# Altium schematic sheet [04] - Display.SchDoc
size A
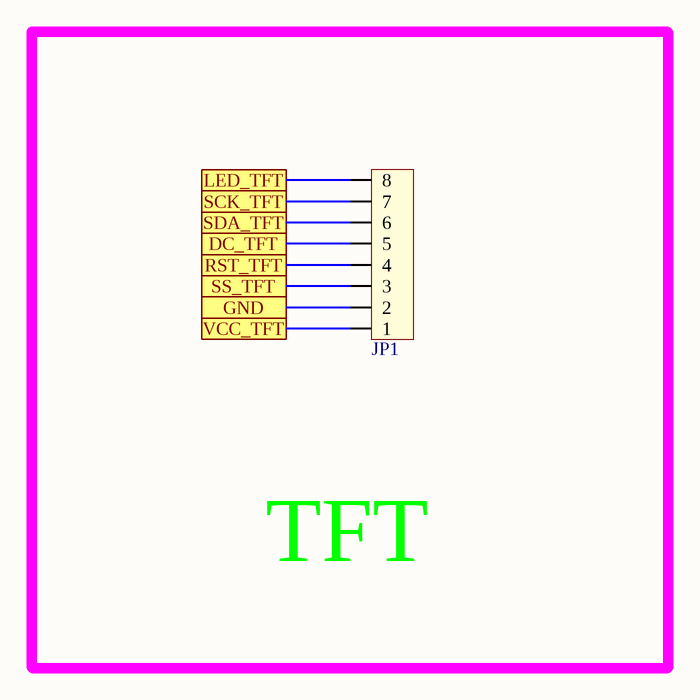
[diagram p0: [04] - Display.SchDoc]

## Parts
JP1  Conn-8  [CON_8P]  (value not drawn)

## Ports
DC_TFT, GND, LED_TFT, RST_TFT, SCK_TFT, SDA_TFT, SS_TFT, VCC_TFT

## Nets
DC_TFT: JP1.5 ; port DC_TFT
GND: JP1.2 ; port GND
LED_TFT: JP1.8 ; port LED_TFT
RST_TFT: JP1.4 ; port RST_TFT
SCK_TFT: JP1.7 ; port SCK_TFT
SDA_TFT: JP1.6 ; port SDA_TFT
SS_TFT: JP1.3 ; port SS_TFT
VCC_TFT: JP1.1 ; port VCC_TFT

## Notes on the sheet
- TFT